# Altium schematic sheet Sheet1.SCHDOC
size 279 x 215 mm; SheetNumber: 1; SheetTotal: 1; DocumentName: Sheet1.SCHDOC
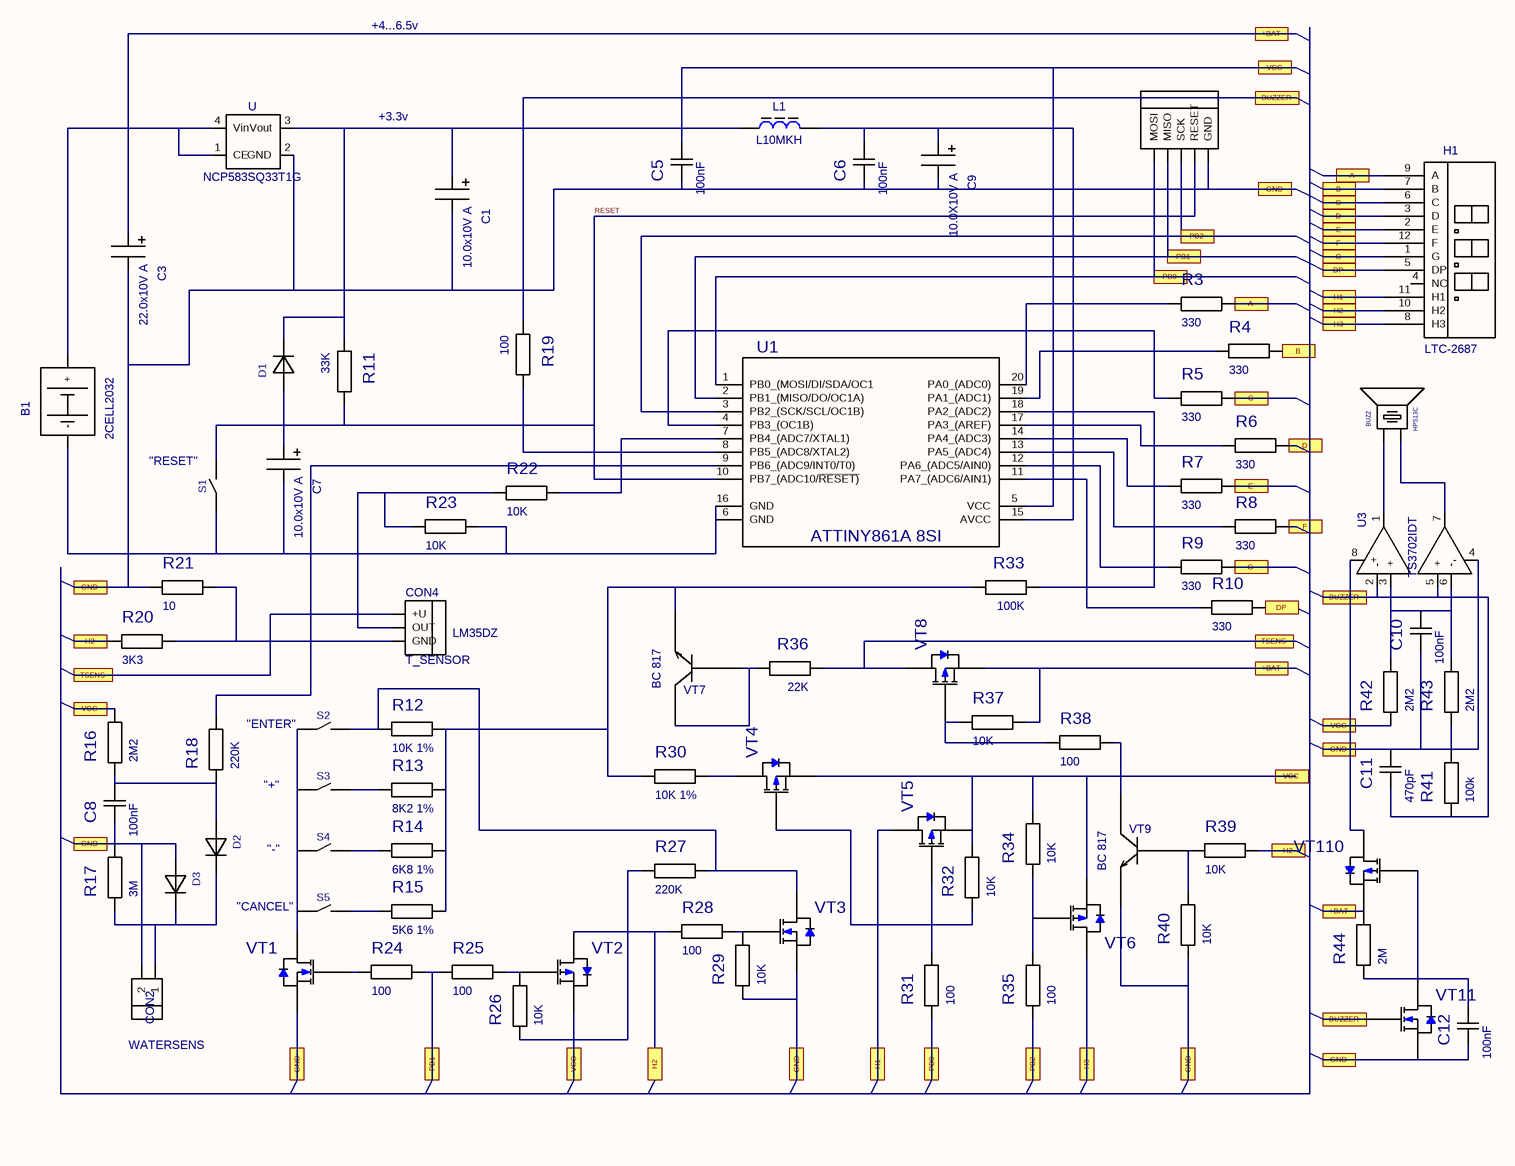
[diagram p0: Sheet1.SCHDOC]

## Parts
B1  2CELL2032  [2CELL2032]
BUZZ  HPS13C  [HPS13C]
C1  value 10.0x10V A  [T1206]  (hidden comment: C_T_1206SMD)
C3  value 22.0x10V A  [T1206]  (hidden comment: C_T_1206SMD)
C5  value 100nF  [C0805]  (hidden comment: C0805)
C6  value 100nF  [C0805]  (hidden comment: C0805)
C7  value 10.0x10V A  [T1206]  (hidden comment: C_T_1206SMD)
C8  value 100nF  [C0805]  (hidden comment: C0805)
C9  value 10.0X10V A  [T1206]  (hidden comment: C_T_1206SMD)
C10  value 100nF  [C0805]  (hidden comment: C0805)
C11  value 470pF  [C0805]  (hidden comment: C0805)
C12  value 100nF  [C0805]  (hidden comment: C0805)
CON1  5PIN  [5PIN]  (value not drawn)
CON2  2PIN  [2PIN]  (value not drawn)
CON4  value T_SENSOR  [3PIN]  (hidden comment: 3PIN)
D1  BAS16  [SOT-23]  (value not drawn)
D2  BAS16  [SOT-23]  (value not drawn)
D3  BAS16  [SOT-23]  (value not drawn)
H1  LTC-2687  [LTC-2687]
L1  L10MKH  [L1208]
R3  value 330  [ERA-0805]  (hidden comment: RES0805)
R4  value 330  [ERA-0805]  (hidden comment: RES0805)
R5  value 330  [ERA-0805]  (hidden comment: RES0805)
R6  value 330  [ERA-0805]  (hidden comment: RES0805)
R7  value 330  [ERA-0805]  (hidden comment: RES0805)
R8  value 330  [ERA-0805]  (hidden comment: RES0805)
R9  value 330  [ERA-0805]  (hidden comment: RES0805)
R10  value 330  [ERA-0805]  (hidden comment: RES0805)
R11  value 33K  [ERA-0805]  (hidden comment: RES0805)
R12  value 10K 1%  [ERA-0805]  (hidden comment: RES0805)
R13  value 8K2 1%  [ERA-0805]  (hidden comment: RES0805)
R14  value 6K8 1%  [ERA-0805]  (hidden comment: RES0805)
R15  value 5K6 1%  [ERA-0805]  (hidden comment: RES0805)
R16  value 2M2  [ERA-0805]  (hidden comment: RES0805)
R17  value 3M  [ERA-0805]  (hidden comment: RES0805)
R18  value 220K  [ERA-0805]  (hidden comment: RES0805)
R19  value 100  [ERA-0805]  (hidden comment: RES0805)
R20  value 3K3  [ERA-0805]  (hidden comment: RES0805)
R21  value 10  [ERA-0805]  (hidden comment: RES0805)
R22  value 10K  [ERA-0805]  (hidden comment: RES0805)
R23  value 10K  [ERA-0805]  (hidden comment: RES0805)
R24  value 100  [ERA-0805]  (hidden comment: RES0805)
R25  value 100  [ERA-0805]  (hidden comment: RES0805)
R26  value 10K  [ERA-0805]  (hidden comment: RES0805)
R27  value 220K  [ERA-0805]  (hidden comment: RES0805)
R28  value 100  [ERA-0805]  (hidden comment: RES0805)
R29  value 10K  [ERA-0805]  (hidden comment: RES0805)
R30  value 10K 1%  [ERA-0805]  (hidden comment: RES0805)
R31  value 100  [ERA-0805]  (hidden comment: RES0805)
R32  value 10K  [ERA-0805]  (hidden comment: RES0805)
R33  value 100K  [ERA-0805]  (hidden comment: RES0805)
R34  value 10K  [ERA-0805]  (hidden comment: RES0805)
R35  value 100  [ERA-0805]  (hidden comment: RES0805)
R36  value 22K  [ERA-0805]  (hidden comment: RES0805)
R37  value 10K  [ERA-0805]  (hidden comment: RES0805)
R38  value 100  [ERA-0805]  (hidden comment: RES0805)
R39  value 10K  [ERA-0805]  (hidden comment: RES0805)
R40  value 10K  [ERA-0805]  (hidden comment: RES0805)
R41  value 100k  [ERA-0805]  (hidden comment: RES0805)
R42  value 2M2  [ERA-0805]  (hidden comment: RES0805)
R43  value 2M2  [ERA-0805]  (hidden comment: RES0805)
R44  value 2M  [ERA-0805]  (hidden comment: RES0805)
S1  IT-1185AU  [IT-1185AU]  (value not drawn)
S2  IT-1185AU  [IT-1185AU]  (value not drawn)
S3  IT-1185AU  [IT-1185AU]  (value not drawn)
S4  IT-1185AU  [IT-1185AU]  (value not drawn)
S5  IT-1185AU  [IT-1185AU]  (value not drawn)
U  NCP583SQ33T1G  [SC 82AB]
U1  ATTINY861A 8SI  [ATTINY461A-8SI]
U3  TS3702IDT  [SO8]
VT1  N-FET SOT23  [PNP SOT23]  (value not drawn)
VT2  P-MFET SOT23  [PNP SOT23]  (value not drawn)
VT3  N-FET SOT23  [PNP SOT23]  (value not drawn)
VT4  P-MFET SOT23  [PNP SOT23]  (value not drawn)
VT5  P-MFET SOT23  [PNP SOT23]  (value not drawn)
VT6  P-MFET SOT23  [PNP SOT23]  (value not drawn)
VT7  BC 817  [NPN PNP SOT23]
VT8  P-MFET SOT23  [PNP SOT23]  (value not drawn)
VT9  BC 817  [NPN PNP SOT23]
VT11  N-FET SOT23  [PNP SOT23]  (value not drawn)
VT110  P-MFET SOT23  [PNP SOT23]  (value not drawn)

## Ports
+BAT, A, B, BUZZER, C, D, DP, E, F, G, GND, H1, H2, H3, PB0, PB1, PB2, TSENS, VCC

## Nets
+BAT: B1.2(+) C3.1 R37.2 R44.2 U.1(CE) U.4(Vin) VT8.2 VT110.2 ; port +BAT
A: H1.9(A) R3.2 ; port A
B: H1.7(B) R4.2 ; port B
BUZZER: C11.1 R19.1 R41.1 U3.2(-) U3.5(+) VT11.1 ; port BUZZER
C: H1.6(C) R5.2 ; port C
D: H1.3(D) R6.2 ; port D
DP: H1.5(DP) R10.2 ; port DP
E: H1.2(E) R7.2 ; port E
F: H1.12(F) R8.2 ; port F
G: H1.1(G) R9.2 ; port G
GND: B1.1(-) C1.2 C3.2 C5.1 C6.1 C7.2 C8.1 C9.2 C10.1 C11.2 C12.1 CON1.5(GND) CON2.2 D3.1 R17.2 R21.1 R23.2 R29.1 R40.1 R41.2 R43.1 S1.1 U.2(GND) U1.6(GND) U1.16(GND) U3.4(-) VT1.2 VT3.2 VT9.2(E) VT11.2 ; port GND
H1: H1.11(H1) VT5.3 ; port H1
H2: H1.10(H2) R20.1 R28.1 R39.2 VT2.3 ; port H2
H3: H1.8(H3) VT6.3 ; port H3
PB0: CON1.1(MOSI) R31.1 U1.1(PB0_(MOSI/DI/SDA/OC1) ; port PB0
PB1: CON1.2(MISO) R24.2 R25.1 U1.2(PB1_(MISO/DO/OC1A)) ; port PB1
PB2: CON1.3(SCK) R35.1 U1.3(PB2_(SCK/SCL/OC1B)) ; port PB2
RESET: C7.1 CON1.4(RESET) D1.1 R11.2 S1.2 U1.10(PB7_(ADC10/~{RESET)})
TSENS: CON4.1(+U) R36.1 VT8.3 ; port TSENS
VCC: C1.1 C5.2 D1.2 L1.1 R11.1 R16.2 R26.1 R27.1 R32.2 R34.2 R42.1 U.3(Vout) U1.5(VCC) VT2.2 VT4.2 VT5.2 VT6.2 ; port VCC
NetBUZZ_1: BUZZ.1 U3.1
NetBUZZ_2: BUZZ.2 U3.7
NetC6_2: C6.2 C9.1 L1.2 U1.15(AVCC)
NetC8_2: C8.2 D2.1 R16.1 R18.1
NetC10_2: C10.2 R42.2 R43.2 U3.3(+) U3.6(-)
NetC12_2: C12.2 R44.1 VT11.3 VT110.1
NetCON2_1: CON2.1 D2.2 D3.2 R17.1
NetCON4_2: CON4.2(OUT) R22.1 R23.1
NetCON4_3: CON4.3(GND) R20.2 R21.2
NetR3_1: R3.1 U1.20(PA0_(ADC0))
NetR4_1: R4.1 U1.19(PA1_(ADC1))
NetR5_1: R5.1 U1.4(PB3_(OC1B))
NetR6_1: R6.1 U1.17(PA3_(AREF))
NetR7_1: R7.1 U1.14(PA4_(ADC3))
NetR8_1: R8.1 U1.13(PA5_(ADC4))
NetR9_1: R9.1 U1.12(PA6_(ADC5/AIN0))
NetR10_1: R10.1 U1.11(PA7_(ADC6/AIN1))
NetR12_1: R12.1 R27.2 S2.2 VT3.3
NetR12_2: R12.2 R13.2 R14.2 R15.2 R30.1 R33.2 VT7.2(E)
NetR13_1: R13.1 S3.2
NetR14_1: R14.1 S4.2
NetR15_1: R15.1 S5.2
NetR18_2: R18.2 U1.9(PB6_(ADC9/INT0/T0))
NetR19_2: R19.2 U1.8(PB5_(ADC8/XTAL2))
NetR22_2: R22.2 U1.7(PB4_(ADC7/XTAL1))
NetR24_1: R24.1 VT1.1
NetR25_2: R25.2 R26.2 VT2.1
NetR28_2: R28.2 R29.2 VT3.1
NetR30_2: R30.2 VT4.3
NetR31_2: R31.2 R32.1 VT4.1 VT5.1
NetR33_1: R33.1 U1.18(PA2_(ADC2))
NetR34_1: R34.1 R35.2 VT6.1
NetR36_2: R36.2 VT7.1(B) VT7.3(C)
NetR37_1: R37.1 R38.1 VT8.1
NetR38_2: R38.2 VT9.3(C)
NetR39_1: R39.1 R40.2 VT9.1(B)
NetS2_1: S2.1 S3.1 S4.1 S5.1 VT1.3
NetU3_8: U3.8(+) VT110.3

Not connected (* = marked no-connect by the designer): H1 4(NC)

## Notes on the sheet
- +4...6.5v
- +3.3v
- (near S1) "RESET"
- (near CON4) LM35DZ
- "ENTER"
- (near S3) "+"
- (near S5) "CANCEL"
- (near S4) "-"
- WATERSENS

## Library data of the parts
CON2 = 2PIN: Value: WATERSENS
U1 = ATTINY861A 8SI: ComponentLink1DescBC: Manufacturer Link; ComponentLink2DescA4: Datasheet; PackageReference: 20S; Published: 17-Sep-2003; LatestRevisionDate: 4-Mar-2005; PackageDocument: Aug-1999; Publisher: Altium Limited; DatasheetDocument: 1477C-AVR-09/02; LatestRevisionNote: Stylized 3D Model Added.; ComponentLink1URL: http://www.atmel.com; ComponentLink2URL: http://www.atmel.com/dyn/resources/prod_documents/doc1477.pdf
VT1 VT3 VT11 = N-FET SOT23: PackageDocument: rev3, May-2000; ComponentLink2DescA4: Datasheet; ComponentLink1DescBC: Manufacturer Link; Published: 17-Sep-2003; DatasheetDocument: 19-May-2000; PackageReference: SOT54; Publisher: Altium Limited; Code_JEDEC: TO-92; ComponentLink1URL: http://www.semiconductors.philips.com/; ComponentLink2URL: http://www.semiconductors.philips.com/acrobat/datasheets/2N7000-03.pdf
  VT1 VT11: Value: *
VT2 VT4-VT6 VT8 VT110 = P-MFET SOT23: ComponentLink2DescA4: Datasheet; ComponentLink1DescBC: Manufacturer Link; Published: 17-Sep-2003; LatestRevisionDate: 6-Jun-2005; DatasheetDocument: 22-May-2002; PackageDocument: Apr-1999; PackageReference: SOT89; Publisher: Altium Limited; Code_JEITA: SC-62; Code_JEDEC: TO-243-AA; Code_IPC: SOT 89; LatestRevisionNote: PCB pad sequence reversed.; ComponentLink1URL: http://www.semiconductors.philips.com/; ComponentLink2URL: http://www.semiconductors.philips.com/acrobat/datasheets/BSS192_3.pdf
B1 = 2CELL2032: Value: *
BUZZ = HPS13C: Value: *
H1 = LTC-2687: Value: *
L1 = L10MKH: Value: *
S1-S5 = IT-1185AU: Value: *
U = NCP583SQ33T1G: Value: *
U3 = TS3702IDT: Value: *
VT7 VT9 = BC 817: Value: *